# Altium schematic sheet [XX] - DOC REVISION HISTORY.SchDoc
size A3; Author: Gabriel Piñango; DocumentNumber: 3; Revision: V1I1; SheetNumber: 3; SheetTotal: 4; Collaborator: Romy Bompart
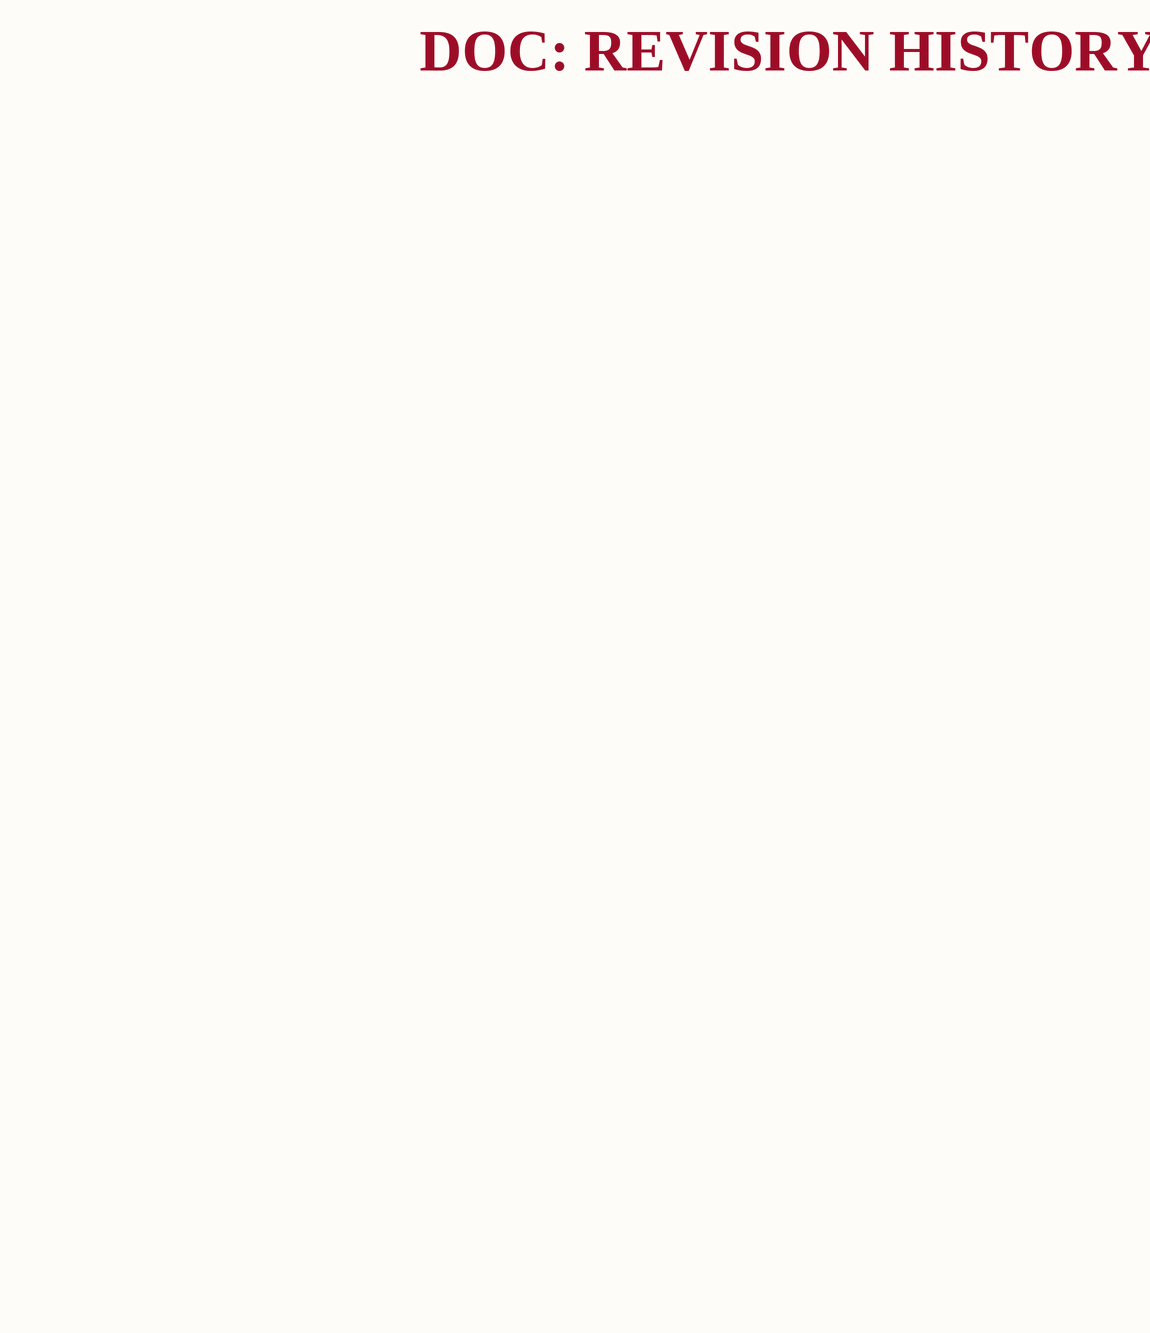
[diagram p0: [XX] - DOC REVISION HISTORY.SchDoc]

## Notes on the sheet
- DOC: REVISION HISTORY
- CLOCKS (CPU & PCIE)
- Título
- Diseñado por
- Fecha:
- Proyecto
- Hora:
- Versión:
- Hoja
- de
- Archivo: